# EAGLE design Adafruit Neo Trinkey (EAGLE 9.6.2)
AUTHOR: ladyada
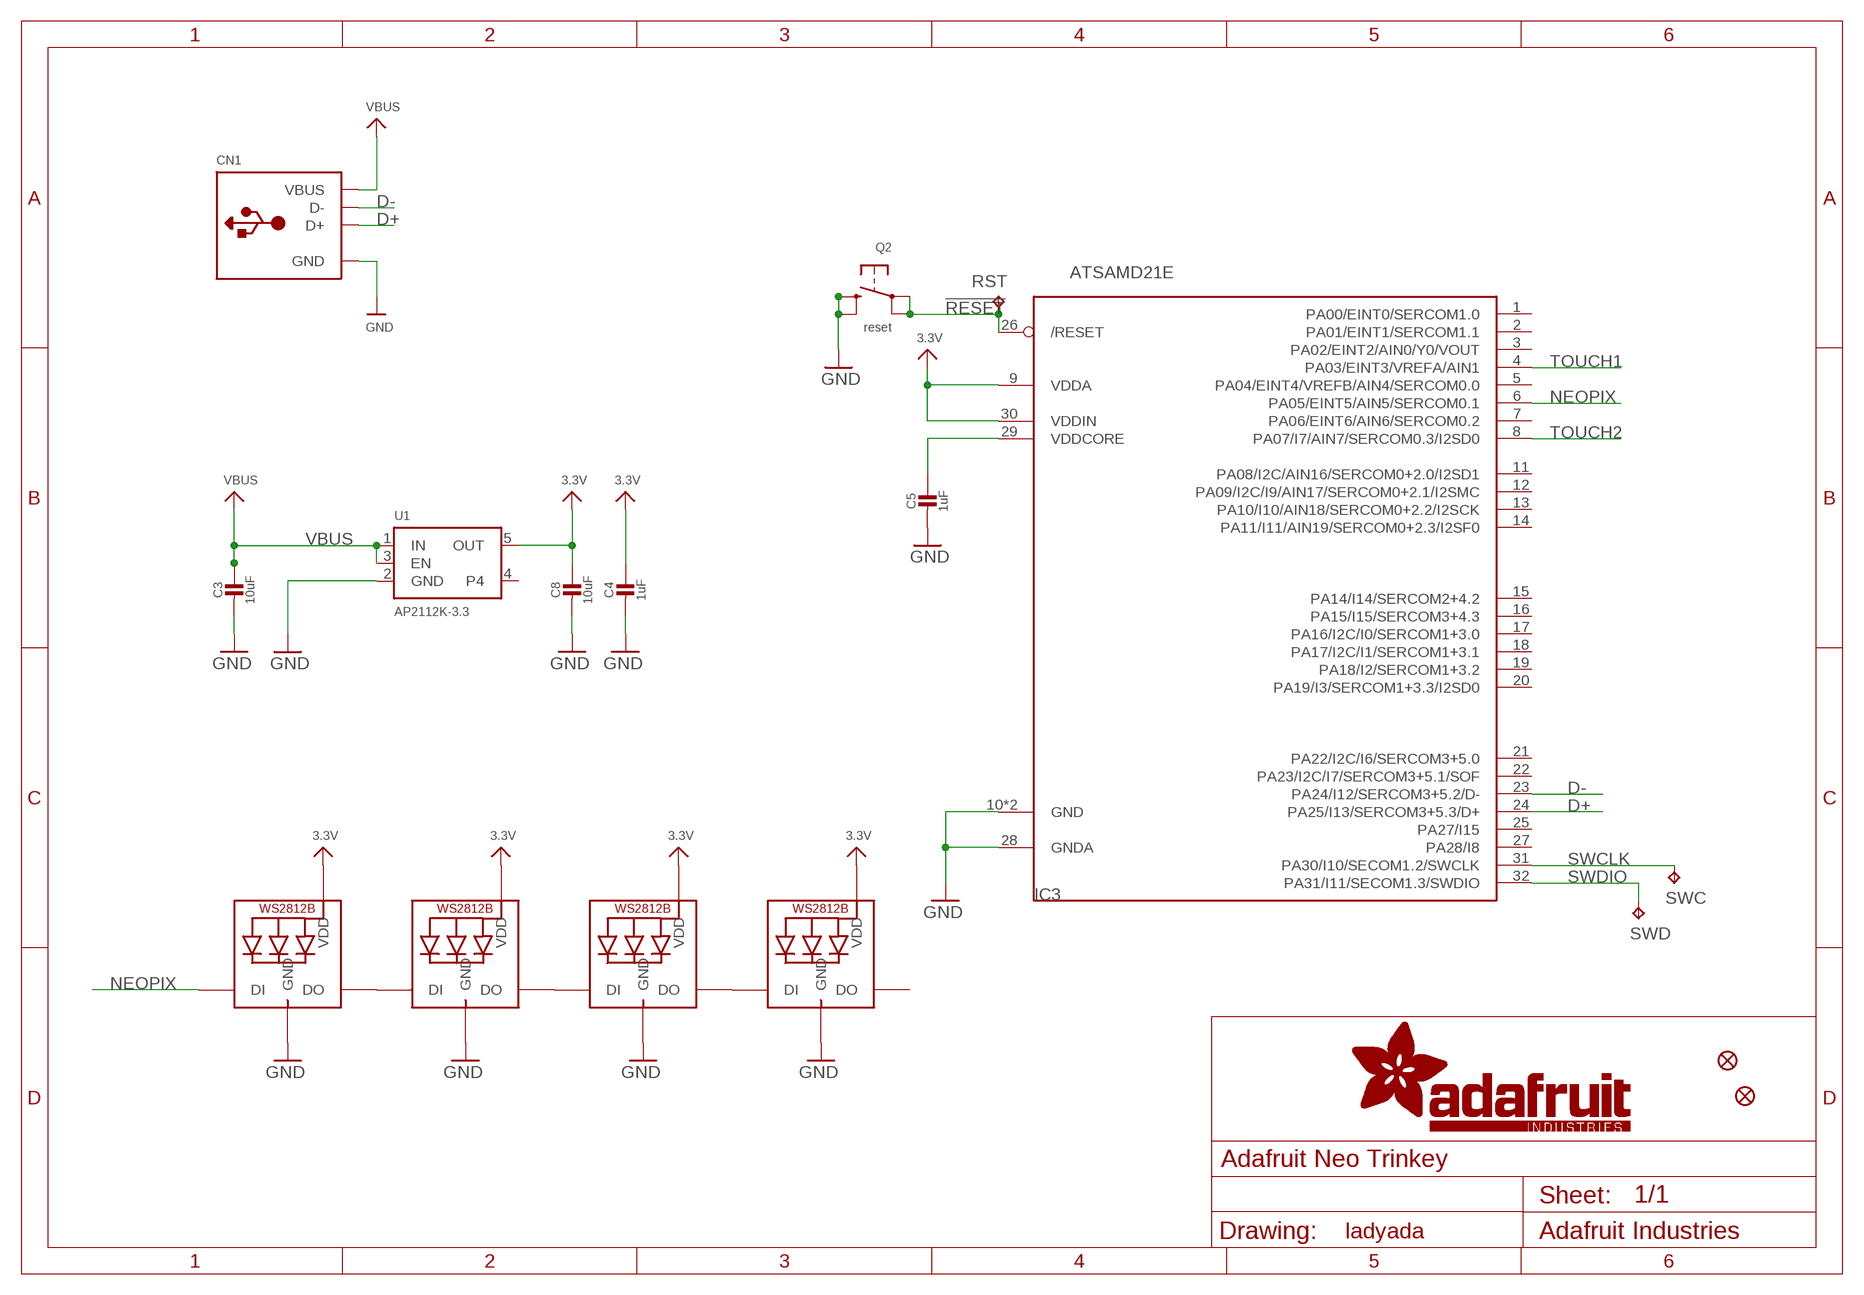
[diagram p0: schematic, sheet 1]

## Parts
C3  10uF  CAP_CERAMIC0805-NOOUTLINE  [0805-NO]
C4  1uF  CAP_CERAMIC0603_NO  [0603-NO]
C5  1uF  CAP_CERAMIC0603_NO  [0603-NO]
C8  10uF  CAP_CERAMIC0805-NOOUTLINE  [0805-NO]
CN1  USB_TYPEAPCB  [USBA_PCB]
FID1  FIDUCIAL_1MM  [FIDUCIAL_1MM]
FID2  FIDUCIAL_1MM  [FIDUCIAL_1MM]
IC3  ATSAMD21E  [QFN32_5MM]
LED1  WS2812B3535  [LED3535]
LED2  WS2812B3535  [LED3535]
LED3  WS2812B3535  [LED3535]
LED4  WS2812B3535  [LED3535]
Q2  reset  SWITCH_TACT_SMT4.6X2.8  [BTN_KMR2_4.6X2.8]
RST  TPTP16R  [TP16R]
SWC  TPTP15R  [TP15R]
SWD  TPTP16R  [TP16R]
U1  AP2112K-3.3  VREG_SOT23-5  [SOT23-5]

## Nets
3.3V: C4.1 C8.1 IC3.9(VDDA) IC3.30(VDDIN) LED1.2(VDD) LED2.2(VDD) LED3.2(VDD) LED4.2(VDD) U1.5(OUT)
!RESET: IC3.26(/RESET) Q2.A'(P1) Q2.A(P) RST.TP
D+: CN1.USB_PLUS(D+) IC3.24(PA25/I13/SERCOM3+5.3/D+)
D-: CN1.USB_NEG(D-) IC3.23(PA24/I12/SERCOM3+5.2/D-)
GND: C3.2 C4.2 C5.2 C8.2 CN1.GND IC3.10(GND) IC3.28(GNDA) IC3.33(GND) LED1.4(GND) LED2.4(GND) LED3.4(GND) LED4.4(GND) Q2.B'(S1) Q2.B(S) U1.2(GND)
N$1: LED1.3(DO) LED2.1(DI)
N$2: LED2.3(DO) LED3.1(DI)
N$3: LED3.3(DO) LED4.1(DI)
NEOPIX: IC3.6(PA05/EINT5/AIN5/SERCOM0.1) LED1.1(DI)
SWCLK: IC3.31(PA30/I10/SECOM1.2/SWCLK) SWC.TP
SWDIO: IC3.32(PA31/I11/SECOM1.3/SWDIO) SWD.TP
TOUCH1: IC3.4(PA03/EINT3/VREFA/AIN1)
TOUCH2: IC3.8(PA07/I7/AIN7/SERCOM0.3/I2SD0)
VBUS: C3.1 CN1.VCC(VBUS) U1.1(IN) U1.3(EN)
VDDCORE1: C5.1 IC3.29(VDDCORE)
Unconnected: IC3.1(PA00/EINT0/SERCOM1.0) IC3.2(PA01/EINT1/SERCOM1.1) IC3.3(PA02/EINT2/AIN0/Y0/VOUT) IC3.5(PA04/EINT4/VREFB/AIN4/SERCOM0.0) IC3.7(PA06/EINT6/AIN6/SERCOM0.2) IC3.11(PA08/I2C/AIN16/SERCOM0+2.0/I2SD1) IC3.12(PA09/I2C/I9/AIN17/SERCOM0+2.1/I2SMC) IC3.13(PA10/I10/AIN18/SERCOM0+2.2/I2SCK) IC3.14(PA11/I11/AIN19/SERCOM0+2.3/I2SF0) IC3.15(PA14/I14/SERCOM2+4.2) IC3.16(PA15/I15/SERCOM3+4.3) IC3.17(PA16/I2C/I0/SERCOM1+3.0) IC3.18(PA17/I2C/I1/SERCOM1+3.1) IC3.19(PA18/I2/SERCOM1+3.2) IC3.20(PA19/I3/SERCOM1+3.3/I2SD0) IC3.21(PA22/I2C/I6/SERCOM3+5.0) IC3.22(PA23/I2C/I7/SERCOM3+5.1/SOF) IC3.25(PA27/I15) IC3.27(PA28/I8) LED4.3(DO) U1.4

## Library data of the parts
C3-C5 C8 = microbuilder:CAP_CERAMIC: Ceramic Capacitors For new designs, use the packages preceded by an '_' character since they are more reliable: The following footprints should be used on most boards: _0402 - Standard footprint for regular board layouts _0603 - Standard footprint for regular board layouts _0805 - Standard footprint for regular board layouts _1206 - Standard footprint for regular board layouts For extremely tight-pitch boards where space is at a premium, the following 'micro-pitch' footprints can be used (smaller pads, no silkscreen outline, etc.): _0402MP - Micro-pitch footprint for very dense/compact boards _0603MP - Micro-pitch footprint for very dense/compact boards _0805MP - Micro-pitch footprint for very dense/compact boards _1206MP - Micro-pitch footprint for very dense/compact boards
CN1 = microbuilder:USB_TYPEA: USB - Type A Connectors Male types stick out and are inserted into a PC or matching females parts (these are the connectors used on USB Memory Sticks, etc.). Female parts are generally used for USB Host and accept a male-type connector. SMT - 4UCON: 10017 PTHFML - Digikey: 609-1045-ND, 4UCon: 05241 PCB - Use 2.0mm thick PCBs with this footprint
FID1 FID2 = microbuilder:FIDUCIAL: Fiducial Alignment Points Various fiducial points for machine vision alignment.; BOM: EXCLUDE
IC3 = microbuilder:ATSAMD21E
LED1-LED4 = adafruit:WS2812B
Q2 = microbuilder:SWITCH_TACT_SMT: SMT Tact Switches 6x6mm - Digikey: P12940SCT-ND KMR2 (4.6x2.8mm) - Digikey: 401-1426-1-ND EVQ-PQHB55 - Light Touch, 160GF (4.5x4.5mm) - Digikey: P8090SCT-ND KMT0 - KMT021 NGJ LHS (etc.) IP68/Waterproof - Digikey: CKN10289CT-ND
RST SWC SWD = testpad:TP: Test pad
U1 = microbuilder:VREG_SOT23-5: SOT23-5 Fixed Voltage Regulators Part Current Out V Out V In V Dropout θJA (°C/W) TJ (°C) Digikey Part No. ADP121 150mA 3.3V 3.4-5.5V 0.09V @ 150mA -- -- ADP121-AUJZ33R7CT-ND ADP121 150mA 3.0V 3.1-5.5V 0.09V @ 150mA -- -- ADP121-AUJZ30R7CT-ND ADP122 300mA 3.3V 3.4-5.5V 0.085V @ 300mA -- -- ADP122AUJZ-3.3-R7CT-ND ADP1712 300mA 3.3V 3.5-5.5V 0.17V @ 300mA -- -- ADP1712AUJZ-3.3-R7TR-ND AP7311 (Low Cost) 150mA 3.3V 3.5-6V 0.15V @ 150mA -- -- AP7311-33WG-7DICT-ND LD39015M18R 150mA 1.8V 1.9V-5.5V 0.08V @ 100mA -- -- 497-6977-1-ND LP2985A-33DBVR 150mA 3.3V 3.3-16V 0.28V @ 150mA 206 150 296-18479-1-ND MCP1824T-3302E/OT 300mA 3.3V 3.5V-6V 0.2V @ 300mA -- -- MCP1824T-3302E/OTCT-ND MIC5205-2.5YM5 TR 150mA 2.5V 2.7-16V 0.165V @ 150mA -- -- 576-1257-2-ND MIC5205-3.0YM5 TR 150mA 3.0V 3.2V-16V 0.165V @ 150mA -- -- 576-1258-2-ND MIC5205-3.3YM5 TR 150mA 3.3V 3.5V-16V 0.165V @ 150mA -- -- 576-1259-2-ND TPS780330220 150mA 3.3V+2.2V 3.6-5.5V 250mV Max -- -- 296-23332-1-ND TDA3663/N1,135 100mA 3.3V 3.5-45V 0.18V @ 50mA -- -- 568-5343-1-ND Max operating temp can be calculated using θJA, TJ (max junction temperature), and power in watts. Set the "Maximum Ambient Temperature" until it reaches TJ ("Max Junction Temperature"), which is the absolute limit for safe use of the regulator: Heat Sink Temperature Calculator <http://www.daycounter.com/Calculators/Heat-Sink-Temperature-Calculator.phtml> For example, With 12V source into a 3.3V LP2985 and a 30mA load, we are dissipating (12V-3.3V) * 0.03A = 0.261W. With a θJA of 206 °C/W, a TJ of 150°C, and 261mW we can safely use the chip without a heat sink up to 75°C (=147.1°C Junction Temperature).

## Board
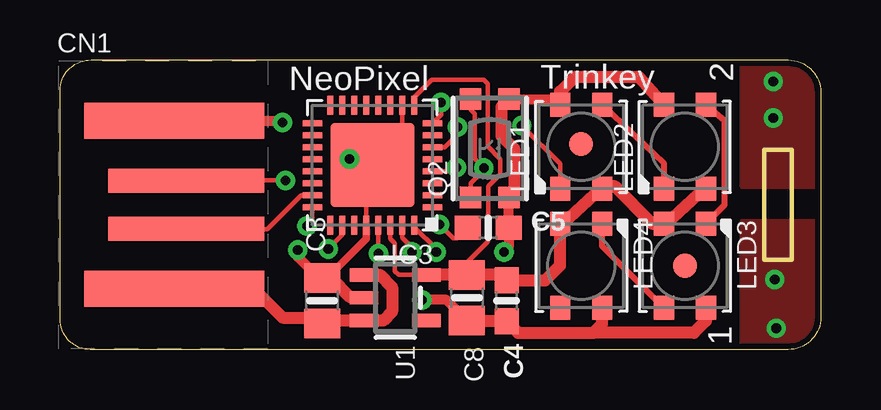
[diagram p1: board, top side]
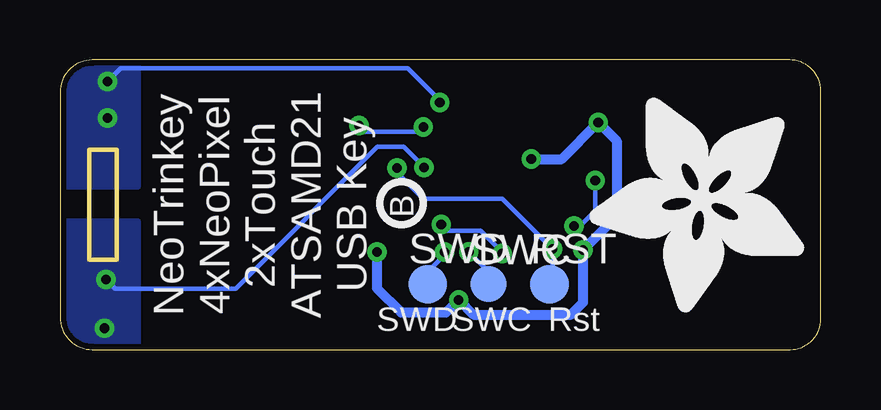
[diagram p2: board, bottom side, seen from below]

Size 31.7 x 12.06 mm. Coordinates in mm from the lower left corner, seen from the top.
Outline: 0,10.8 arc-90 1.3,12.06 30.35,12.06 arc-90 31.7,10.71 31.7,1.35 arc-90 30.35,0 1.27,0 arc-90 0,1.27 0,10.8
Copper layers (1*16): Top 0.035mm / dielectric 1.5mm / Bottom 0.035mm
Design rules "adafruit 7-7": minimum track width 6mil, minimum drill 15.5mil, track to track 8mil, track to pad 7mil, pad to pad 7mil, via to via 7mil, smd to smd 7mil, copper to edge 10mil, drill to drill 8mil, minimum pad ring 10mil, minimum via ring 8mil, stop-mask expansion 2mil, vias tented up to drill 20mil, thermal gap 10mil
Milling: 4 lines

### Footprints (pad centres in the part's own frame; a part is rotated, then mirrored left to right if it is on the bottom)
0805-NO = smd 1.24 x 1.5: 1 -0.95,0; 2 0.95,0
0603-NO = smd 1.075 x 1: 1 -0.85,0; 2 0.85,0
USBA_PCB = smd 7.5 x 1.5: GND -0.2,3.5; VCC -0.2,-3.5 | smd 6.5 x 1: USB_NEG 0.3,-1; USB_PLUS 0.3,1
FIDUCIAL_1MM = smd 1 x 1: 1 0,0
QFN32_5MM = smd 0.8 x 0.25: 1 -2.5,1.75; 2 -2.5,1.25; 3 -2.5,0.75; 4 -2.5,0.25; 5 -2.5,-0.25; 6 -2.5,-0.75; 7 -2.5,-1.25; 8 -2.5,-1.75; 17 2.5,-1.75; 18 2.5,-1.25; 19 2.5,-0.75; 20 2.5,-0.25; 21 2.5,0.25; 22 2.5,0.75; 23 2.5,1.25; 24 2.5,1.75 | smd 0.25 x 0.8: 9 -1.75,-2.5; 10 -1.25,-2.5; 11 -0.75,-2.5; 12 -0.25,-2.5; 13 0.25,-2.5; 14 0.75,-2.5; 15 1.25,-2.5; 16 1.75,-2.5; 25 1.75,2.5; 26 1.25,2.5; 27 0.75,2.5; 28 0.25,2.5; 29 -0.25,2.5; 30 -0.75,2.5; 31 -1.25,2.5; 32 -1.75,2.5 | smd 3.5 x 3.5: 33 0,0
LED3535 = smd 1 x 0.85: 1 -1.75,0.875; 2 -1.75,-0.875; 3 1.75,-0.875; 4 1.75,0.875
BTN_KMR2_4.6X2.8 = smd 0.9 x 0.9: A 2.05,0.8; A' -2.05,0.8; B 2.05,-0.8; B' -2.05,-0.8
TP16R = smd 1.6 x 1.6: TP 0,0
TP15R = smd 1.5 x 1.5: TP 0,0
SOT23-5 = smd 0.55 x 1.2: 1 -0.95,-1.3; 2 0,-1.3; 3 0.95,-1.3; 4 0.95,1.3; 5 -0.95,1.3

### Placement (x,y rotation side)
C3  10.92,2.03 90 top
C4  18.61,2.03 270 top
C5  17.84,5.08 0 top
C8  16.95,2.16 270 top
CN1  4.95,6.03 0 top
FID1  21.72,8.57 0 top
FID2  26.05,3.49 0 top
IC3  13.02,7.68 180 top
LED1  21.72,8.45 90 top
LED2  26.04,8.45 90 top
LED3  26.04,3.49 270 top
LED4  21.72,3.49 270 top
Q2  17.91,8.38 90 top
RST  11.3,2.73 0 bottom
SWC  13.84,2.73 0 bottom
SWD  16.38,2.73 0 bottom
U1  13.97,2.16 270 top
U$8  [PCBFEAT-REV-040]  17.46,6.1 270 bottom
U$10  [ADAFRUIT_9MM]  0.7,10.48 180 bottom

### Tracks (layer width: path | path; a pad name or v marks a point on that pad's centre or on a via)
3.3V
  Top 0.178: IC3.30 13.77,4.61 13.96,4.42 13.96,3.26 14.11,3.11 U1.5 | C8.1 16.96,3.62 17.83,4.49 17.84,6.79 18.35,7.3 18.35,7.94 17.82,8.47 17.82,11.07 17.65,11.24 15.49,11.24 14.77,10.51 IC3.9
  Top 0.508: U1.5 C8.1 18.38,3.11 C4.1 20.22,2.88 20.84,3.51 LED4.2 20.95,5.24 22.53,6.7 LED1.2 23.09,6.82 24.67,5.24 LED3.2 25.26,5.24 26.84,6.7 LED2.2
!RESET  (via drill 0.4)
  Top 0.178: IC3.26 11.77,4.78 v11.18,4.19 | Q2.A 17.11,9.99 17.28,9.82 17.28,7.95 v17.66,7.57 17.66,7.47 17.11,6.92 Q2.A'
  Bottom 0.178: RST.TP 11.18,2.86 v11.18,4.19 13.28,6.29 16.57,6.29 17.66,7.38 v17.66,7.57
D+  (via drill 0.4)
  Top 0.178: IC3.24 10.52,5.37 v10.29,5.14 | CN1.USB_PLUS 5.27,7.05 v9.4,7.05
  Bottom 0.178: v10.29,5.14 10.03,5.14 9.4,5.78 v9.4,7.05
D-
  Top 0.178: IC3.23 10.05,6.43 8.64,5.02 5.27,5.02 CN1.USB_NEG
GND  (via drill 0.4)
  Top 0.178: IC3.28 12.77,7.43 IC3.33 | IC3.10 14.27,8.93 IC3.33 | 9.2,9.53 v9.27,9.46 | IC3.33 12.32,7.68 v12.07,7.94
  Top 0.305: IC3.28 12.77,4.61 11.14,2.98 C3.2
  Top 0.406: CN1.GND 9.2,9.53 | C3.2 10.79,2.98 9.91,3.86 v9.91,4.15 | Q2.B' 18.69,6.32 C5.2 18.69,4.26 v18.5,4.07 | LED1.4 20.61,10.43 Q2.B | C8.2 16.09,2.07 v15.09,2.07
  Top 0.508: U1.2 12.12,2.16 11.29,2.98 C3.2 | C8.2 16.98,1.18 C4.2 19.09,0.7 22.22,0.7 | 22.22,0.7 22.59,1.07 LED4.4 | LED3.4 26.91,1.19 26.42,0.7 22.22,0.7 | LED1.4 20.84,10.75 21.46,11.37 24.12,11.37 LED2.4 | Q2.B' 18.85,6.33 18.92,6.4 18.92,8.37 18.39,8.9 18.39,10.11 Q2.B
  Bottom 0.406: v12.07,7.94 10.79,7.94 v9.27,9.46 8.51,8.7 8.51,5.55 9.78,4.28 10.03,4.28 v9.91,4.15 9.91,1.97 10.41,1.46 14.48,1.46 v15.09,2.07 15.61,1.55 17.49,1.55 18.5,2.56 v18.5,4.07
N$1
  Top 0.254: LED1.3 25.16,7.75 LED2.1
N$2
  Top 0.254: LED2.3 27.69,9.55 27.69,6.02 LED3.1
N$3
  Top 0.254: LED3.3 22.59,4.31 LED4.1
NEOPIX  (via drill 0.4)
  Top 0.178: v16.56,9.27 16.56,8.95 16.04,8.43 IC3.6 | v19.24,9.33 20.84,7.73 LED1.1
  Bottom 0.178: v19.24,9.33 18.99,9.08 16.82,9.08 16.62,9.27 v16.56,9.27
SWCLK  (via drill 0.4)
  Top 0.178: IC3.31 14.27,4.66 14.67,4.25 v14.67,4.06
  Bottom 0.178: v14.67,4.06 13.84,3.24 SWC.TP
SWDIO  (via drill 0.4)
  Top 0.178: IC3.32 14.77,5.1 15.68,4.2 v15.68,4.07
  Bottom 0.178: v15.68,4.07 15.68,3.94 16.37,3.25 SWD.TP
TOUCH1  (via drill 0.4)
  Top 0.178: v16.53,7.59 16.37,7.43 IC3.4
  Bottom 0.178: v16.53,7.59 17.39,8.45 18.48,8.45 24.38,2.54 29.4,2.54 v29.78,2.92
  other vias: 29.84,0.89
  pour Top: 28.45,5.33 31.69,5.33 31.69,0 28.45,0
  pour Bottom: 28.45,5.33 31.69,5.33 31.69,0.06 28.45,0.06
TOUCH2  (via drill 0.4)
  Top 0.178: IC3.8 15.88,9.79 v15.88,10.29
  Bottom 0.178: v15.88,10.29 15.88,10.39 17.21,11.72 29.17,11.72 v29.72,11.18
  other vias: 29.72,9.65
  pour Top: 28.45,12.06 31.69,12.06 31.69,6.79 28.45,6.79
  pour Bottom: 28.45,12.06 31.69,12.06 31.69,6.79 28.45,6.79
VBUS
  Top 0.508: CN1.VCC 8.07,2.53 9.27,1.33 10.92,1.33 C3.1 11.05,1.21 U1.3 13.46,1.21 13.84,1.59 13.84,2.6 13.34,3.11 U1.1
VDDCORE1  (via drill 0.4)
  Top 0.178: IC3.29 v13.27,4 | C5.1 16.55,4.64 16.38,4.64 v15.81,5.21
  Bottom 0.178: v13.27,4 13.27,4.06 14.16,4.95 15.56,4.95 v15.81,5.21

### Text on the board
tPlace: NeoPixel | Trinkey | 2 | 1
bPlace: NeoTrinkey / 4xNeoPixel / 2xTouch / ATSAMD21 / USB Key | Rst | SWC | SWD
tValues: C1898